# EAGLE design axiom_beta_plugin_module_3xmDP_v1.1 (EAGLE 7.0.0)
Assembly variants: Beta
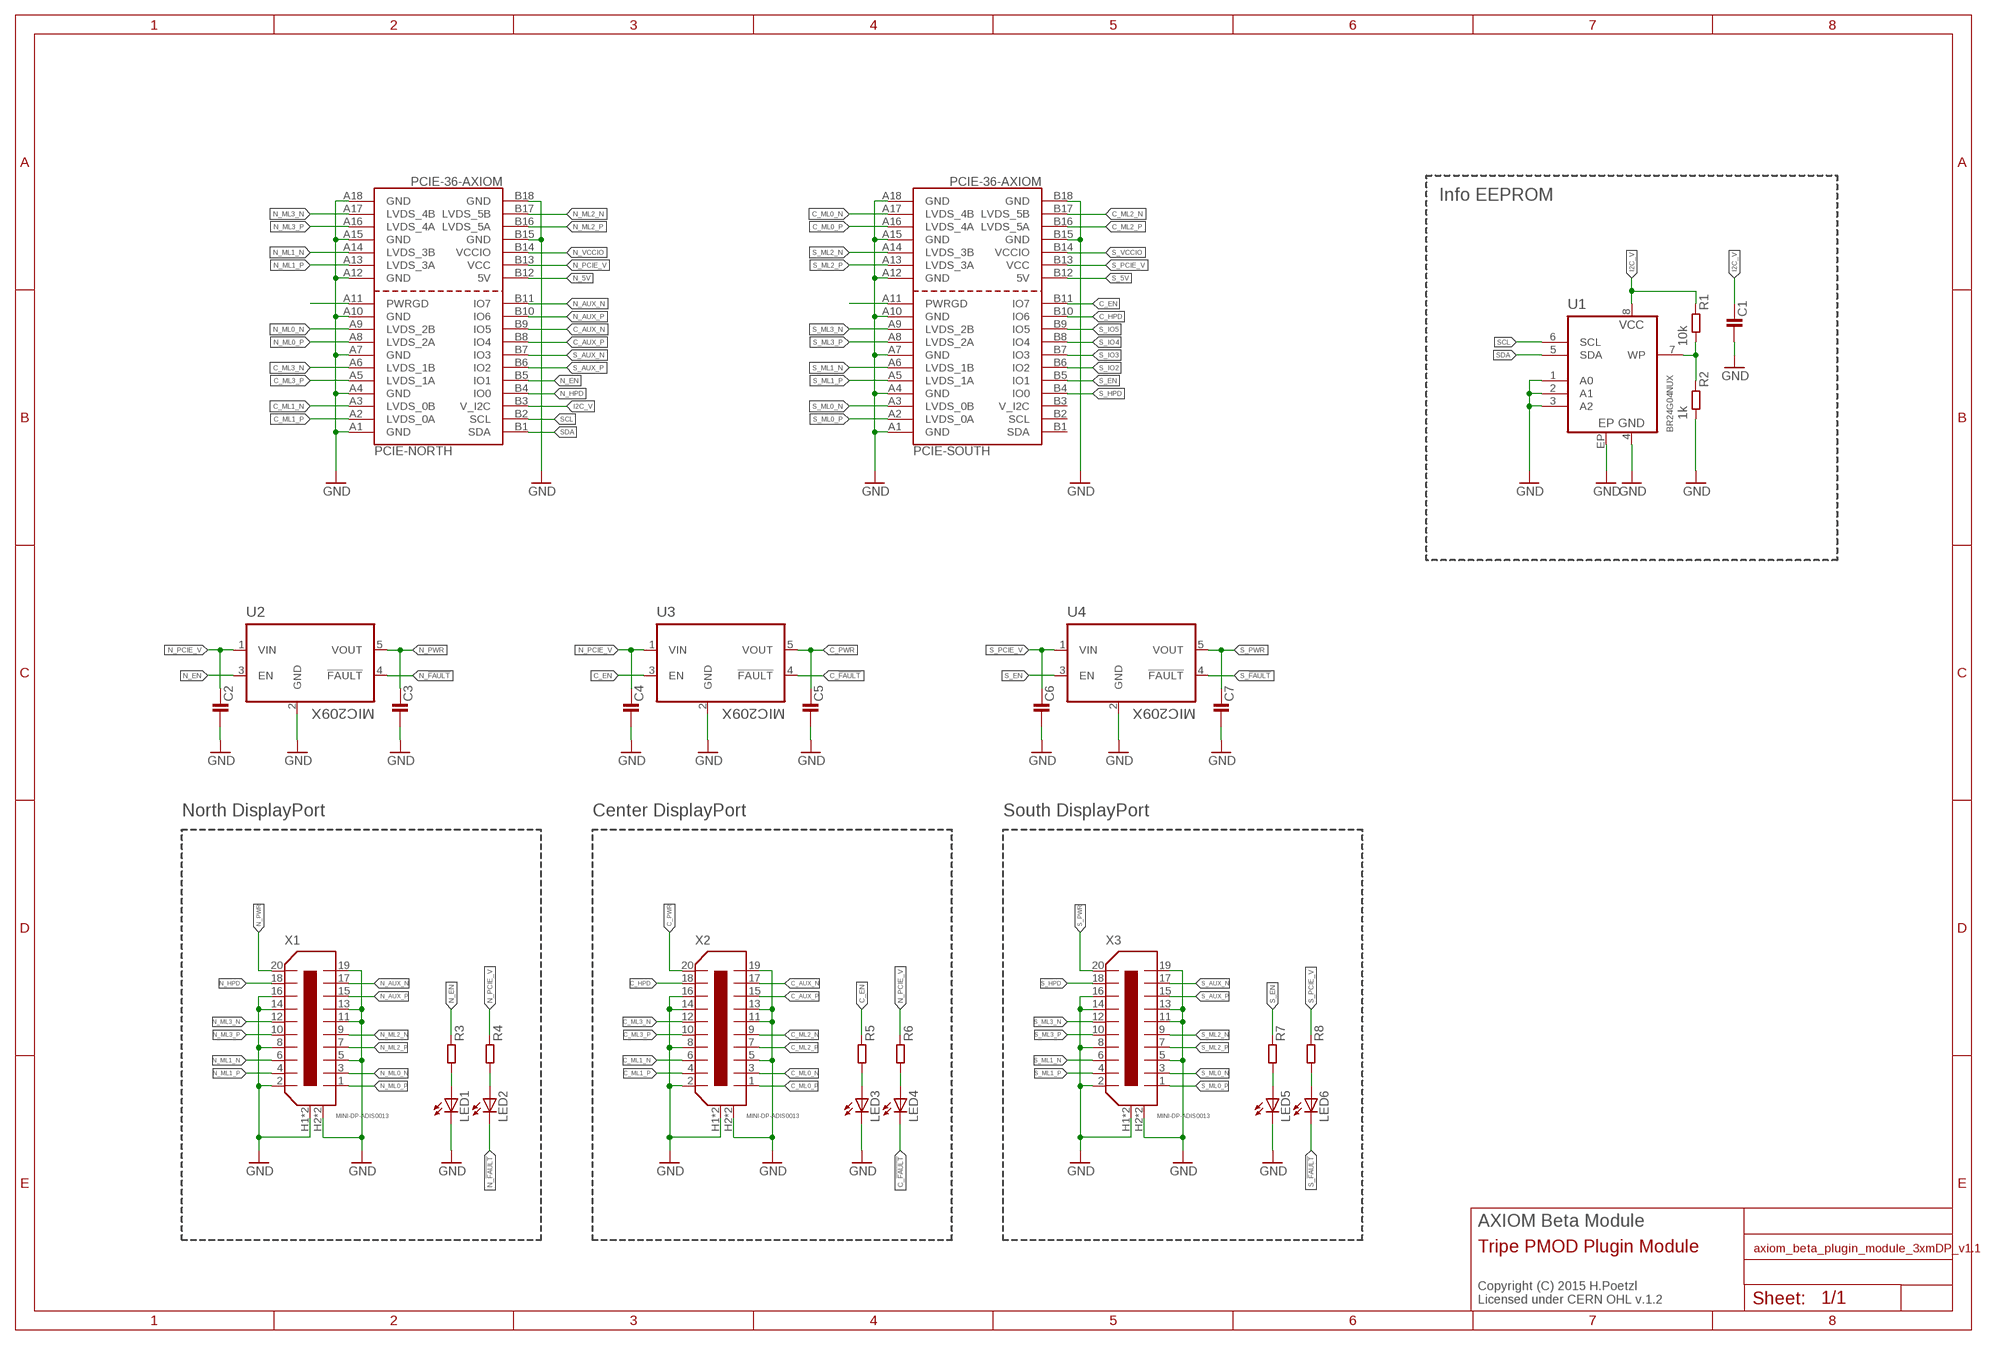
[diagram p0: schematic, sheet 1]

## Parts
C1  C0402-B  [0402-B]
C2  C0603-B  [0603-B]
C3  C0603-B  [0603-B]
C4  C0603-B  [0603-B]
C5  C0603-B  [0603-B]
C6  C0603-B  [0603-B]
C7  C0603-B  [0603-B]
LED1  LEDCHIPLED_0603  [CHIPLED_0603]
LED2  LEDCHIPLED_0603  [CHIPLED_0603]
LED3  LEDCHIPLED_0603  [CHIPLED_0603]
LED4  LEDCHIPLED_0603  [CHIPLED_0603]
LED5  LEDCHIPLED_0603  [CHIPLED_0603]
LED6  LEDCHIPLED_0603  [CHIPLED_0603]
PCIE-NORTH  PCIE-36-AXIOM  [PCIE-36-AXIOM]  (not fitted in variant Beta)
PCIE-SOUTH  PCIE-36-AXIOM  [PCIE-36-AXIOM]  (not fitted in variant Beta)
R1  10k  R0402-B  [0402-B]
R2  1k  R0402-B  [0402-B]
R3  R0402-B  [0402-B]
R4  R0402-B  [0402-B]
R5  R0402-B  [0402-B]
R6  R0402-B  [0402-B]
R7  R0402-B  [0402-B]
R8  R0402-B  [0402-B]
U1  BR24G04NUX  [DFN200X300X100-9N]
U2  MIC209X  [SOT95P280X145-5N]
U3  MIC209X  [SOT95P280X145-5N]
U4  MIC209X  [SOT95P280X145-5N]
X1  MINI-DP-ADIS0013  [ADIS0013]
X2  MINI-DP-ADIS0013  [ADIS0013]
X3  MINI-DP-ADIS0013  [ADIS0013]

## Nets
C_!FAULT: LED4.C U3.4(!FAULT)
C_AUX_N: PCIE-NORTH.B9(IO5) X2.17
C_AUX_P: PCIE-NORTH.B8(IO4) X2.15
C_EN: PCIE-SOUTH.B11(IO7) R5.1 U3.3(EN)
C_HPD: PCIE-SOUTH.B10(IO6) X2.18
C_ML0_N: PCIE-SOUTH.A17(LVDS_4B) X2.3
C_ML0_P: PCIE-SOUTH.A16(LVDS_4A) X2.1
C_ML1_N: PCIE-NORTH.A3(LVDS_0B) X2.6
C_ML1_P: PCIE-NORTH.A2(LVDS_0A) X2.4
C_ML2_N: PCIE-SOUTH.B17(LVDS_5B) X2.9
C_ML2_P: PCIE-SOUTH.B16(LVDS_5A) X2.7
C_ML3_N: PCIE-NORTH.A6(LVDS_1B) X2.12
C_ML3_P: PCIE-NORTH.A5(LVDS_1A) X2.10
C_PWR: C5.1 U3.5(VOUT) X2.20
GND: C1.2 C2.2 C3.2 C4.2 C5.2 C6.2 C7.2 LED1.C LED3.C LED5.C PCIE-NORTH.A1(GND) PCIE-NORTH.A4(GND) PCIE-NORTH.A7(GND) PCIE-NORTH.A10(GND) PCIE-NORTH.A12(GND) PCIE-NORTH.A15(GND) PCIE-NORTH.A18(GND) PCIE-NORTH.B15(GND) PCIE-NORTH.B18(GND) PCIE-SOUTH.A1(GND) PCIE-SOUTH.A4(GND) PCIE-SOUTH.A7(GND) PCIE-SOUTH.A10(GND) PCIE-SOUTH.A12(GND) PCIE-SOUTH.A15(GND) PCIE-SOUTH.A18(GND) PCIE-SOUTH.B15(GND) PCIE-SOUTH.B18(GND) R2.2 U1.1(A0) U1.2(A1) U1.3(A2) U1.4(GND) U1.EP U2.2(GND) U3.2(GND) U4.2(GND) X1.2 X1.5 X1.8 X1.11 X1.13 X1.14 X1.16 X1.19 X1.H1(M) X1.H2(M) X1.H3(M) X1.H4(M) X2.2 X2.5 X2.8 X2.11 X2.13 X2.14 X2.16 X2.19 X2.H1(M) X2.H2(M) X2.H3(M) X2.H4(M) X3.2 X3.5 X3.8 X3.11 X3.13 X3.14 X3.16 X3.19 X3.H1(M) X3.H2(M) X3.H3(M) X3.H4(M)
I2C_V: C1.1 PCIE-NORTH.B3(V_I2C) R1.1 U1.8(VCC)
N$196: LED3.A R5.2
N$197: LED4.A R6.2
N$198: LED1.A R3.2
N$202: LED2.A R4.2
N$209: PCIE-NORTH.A11(PWRGD)
N$216: R1.2 R2.1 U1.7(WP)
N$256: PCIE-SOUTH.A11(PWRGD)
N$324: LED5.A R7.2
N$325: LED6.A R8.2
N_5V: PCIE-NORTH.B12(5V)
N_!FAULT: LED2.C U2.4(!FAULT)
N_AUX_N: PCIE-NORTH.B11(IO7) X1.17
N_AUX_P: PCIE-NORTH.B10(IO6) X1.15
N_EN: PCIE-NORTH.B5(IO1) R3.1 U2.3(EN)
N_HPD: PCIE-NORTH.B4(IO0) X1.18
N_ML0_N: PCIE-NORTH.A9(LVDS_2B) X1.3
N_ML0_P: PCIE-NORTH.A8(LVDS_2A) X1.1
N_ML1_N: PCIE-NORTH.A14(LVDS_3B) X1.6
N_ML1_P: PCIE-NORTH.A13(LVDS_3A) X1.4
N_ML2_N: PCIE-NORTH.B17(LVDS_5B) X1.9
N_ML2_P: PCIE-NORTH.B16(LVDS_5A) X1.7
N_ML3_N: PCIE-NORTH.A17(LVDS_4B) X1.12
N_ML3_P: PCIE-NORTH.A16(LVDS_4A) X1.10
N_PCIE_V: C2.1 C4.1 PCIE-NORTH.B13(VCC) R4.1 R6.1 U2.1(VIN) U3.1(VIN)
N_PWR: C3.1 U2.5(VOUT) X1.20
N_VCCIO: PCIE-NORTH.B14(VCCIO)
S_5V: PCIE-SOUTH.B12(5V)
S_!FAULT: LED6.C U4.4(!FAULT)
S_AUX_N: PCIE-NORTH.B7(IO3) X3.17
S_AUX_P: PCIE-NORTH.B6(IO2) X3.15
S_EN: PCIE-SOUTH.B5(IO1) R7.1 U4.3(EN)
S_HPD: PCIE-SOUTH.B4(IO0) X3.18
S_IO2: PCIE-SOUTH.B6(IO2)
S_IO3: PCIE-SOUTH.B7(IO3)
S_IO4: PCIE-SOUTH.B8(IO4)
S_IO5: PCIE-SOUTH.B9(IO5)
S_ML0_N: PCIE-SOUTH.A3(LVDS_0B) X3.3
S_ML0_P: PCIE-SOUTH.A2(LVDS_0A) X3.1
S_ML1_N: PCIE-SOUTH.A6(LVDS_1B) X3.6
S_ML1_P: PCIE-SOUTH.A5(LVDS_1A) X3.4
S_ML2_N: PCIE-SOUTH.A14(LVDS_3B) X3.9
S_ML2_P: PCIE-SOUTH.A13(LVDS_3A) X3.7
S_ML3_N: PCIE-SOUTH.A9(LVDS_2B) X3.12
S_ML3_P: PCIE-SOUTH.A8(LVDS_2A) X3.10
S_PCIE_V: C6.1 PCIE-SOUTH.B13(VCC) R8.1 U4.1(VIN)
S_PWR: C7.1 U4.5(VOUT) X3.20
S_VCCIO: PCIE-SOUTH.B14(VCCIO)
SCL: PCIE-NORTH.B2(SCL) U1.6(SCL)
SDA: PCIE-NORTH.B1(SDA) U1.5(SDA)
Unconnected: PCIE-SOUTH.B1(SDA) PCIE-SOUTH.B2(SCL) PCIE-SOUTH.B3(V_I2C)

## Notes on the sheet
- Info EEPROM
- North DisplayPort | Center DisplayPort | South DisplayPort
- AXIOM Beta Module
- Tripe PMOD Plugin Module
- Copyright (C) 2015 H.Poetzl
  Licensed under CERN OHL v.1.2

## Library data of the parts
C1-C7 = generic-rcl:C
LED1-LED6 = led:LED: LED OSRAM: - CHIPLED LG R971, LG N971, LY N971, LG Q971, LY Q971, LO R971, LY R971 LH N974, LH R974 LS Q976, LO Q976, LY Q976 LO Q996 - Hyper CHIPLED LW Q18S LB Q993, LB Q99A, LB R99A - SideLED LS A670, LO A670, LY A670, LG A670, LP A670 LB A673, LV A673, LT A673, LW A673 LH A674 LY A675 LS A676, LA A676, LO A676, LY A676, LW A676 LS A679, LY A679, LG A679 - Hyper Micro SIDELED® LS Y876, LA Y876, LO Y876, LY Y876 LT Y87S - SmartLED LW L88C, LW L88S LB L89C, LB L89S, LG L890 LS L89K, LO L89K, LY L89K LS L896, LA L896, LO L896, LY L896 - TOPLED LS T670, LO T670, LY T670, LG T670, LP T670 LSG T670, LSP T670, LSY T670, LOP T670, LYG T670 LG T671, LOG T671, LSG T671 LB T673, LV T673, LT T673, LW T673 LH T674 LS T676, LA T676, LO T676, LY T676, LB T676, LH T676, LSB T676, LW T676 LB T67C, LV T67C, LT T67C, LS T67K, LO T67K, LY T67K, LW E67C LS E67B, LA E67B, LO E67B, LY E67B, LB E67C, LV E67C, LT E67C LW T67C LS T679, LY T679, LG T679 LS T770, LO T770, LY T770, LG T770, LP T770 LB T773, LV T773, LT T773, LW T773 LH T774 LS E675, LA E675, LY E675, LS T675 LS T776, LA T776, LO T776, LY T776, LB T776 LHGB T686 LT T68C, LB T68C - Hyper Mini TOPLED® LB M676 - Mini TOPLED Santana® LG M470 LS M47K, LO M47K, LY M47K Source: http://www.osram.convergy.de LUXEON: - LUMILED® LXK2-PW12-R00, LXK2-PW12-S00, LXK2-PW14-U00, LXK2-PW14-V00 LXK2-PM12-R00, LXK2-PM12-S00, LXK2-PM14-U00 LXK2-PE12-Q00, LXK2-PE12-R00, LXK2-PE12-S00, LXK2-PE14-T00, LXK2-PE14-U00 LXK2-PB12-K00, LXK2-PB12-L00, LXK2-PB12-M00, LXK2-PB14-N00, LXK2-PB14-P00, LXK2-PB14-Q00 LXK2-PR12-L00, LXK2-PR12-M00, LXK2-PR14-Q00, LXK2-PR14-R00 LXK2-PD12-Q00, LXK2-PD12-R00, LXK2-PD12-S00 LXK2-PH12-R00, LXK2-PH12-S00 LXK2-PL12-P00, LXK2-PL12-Q00, LXK2-PL12-R00 Source: www.luxeon.com KINGBRIGHT: KA-3528ASYC Source: www.kingbright.com
PCIE-NORTH PCIE-SOUTH = PCIe:PCIE-36-AXIOM
R1-R8 = generic-rcl:R
U1 = eeprom:BR24G04
U2-U4 = mic209x:MIC209X: Current Limiting Power Distribution Switches; MPN: MIC2090-1YM5TR; OC_FARNELL: 1924707; OC_NEWARK: 58T4896; PACKAGE: SOT-23-5; SUPPLIER: MICREL SEMICONDUCTOR
X1-X3 = displayport:MINI-DP: RIGHT ANGLE MINI-DISPLAYPORT RECEPTACLE Source: http://www.molex.com/pdm_docs/sd/1050810001_sd.pdf

## Net classes
0 default: width 0.152 mm, drill 0.254 mm, clearance 0.152 mm
1 LVDS: width 0.152 mm, drill 0.254 mm, clearance 0.152 mm

## Board
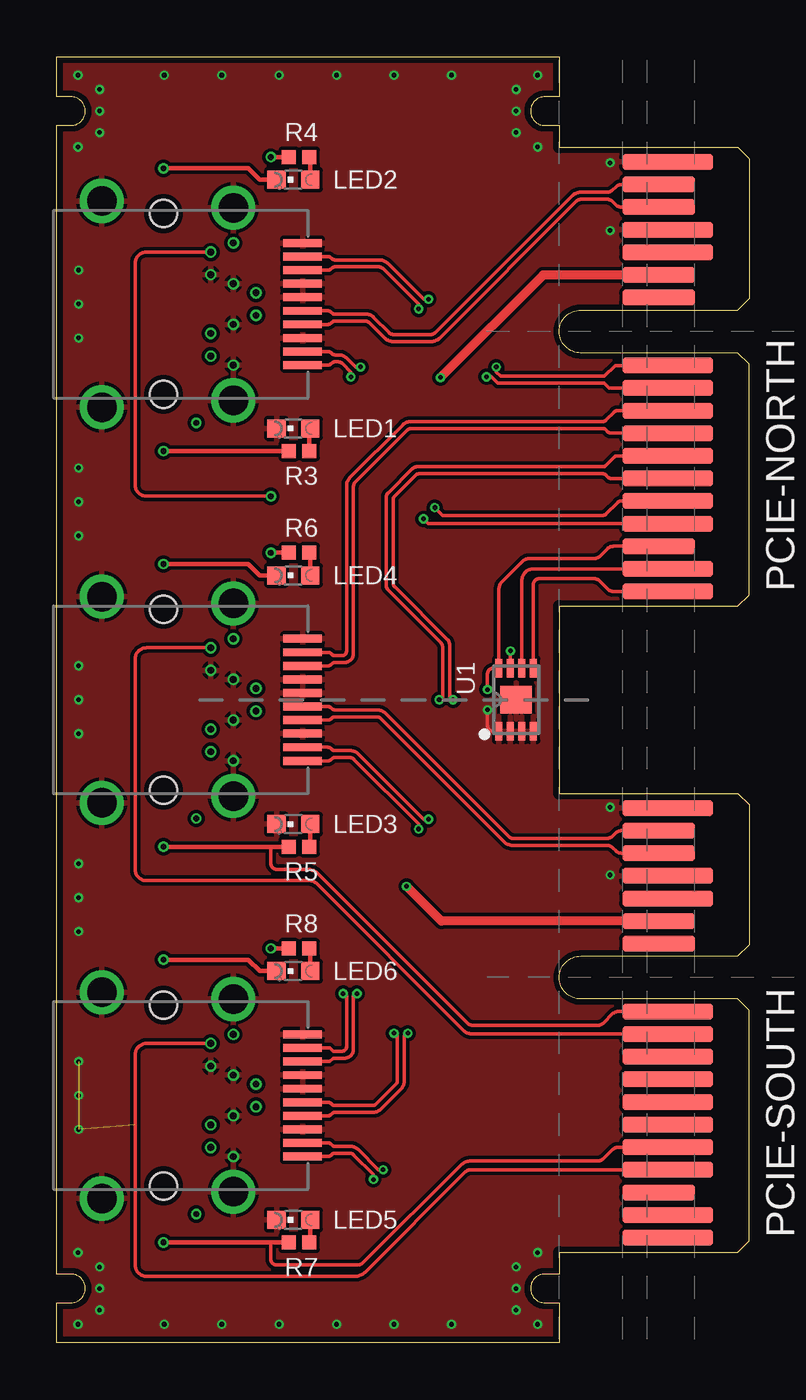
[diagram p1: board, top side]
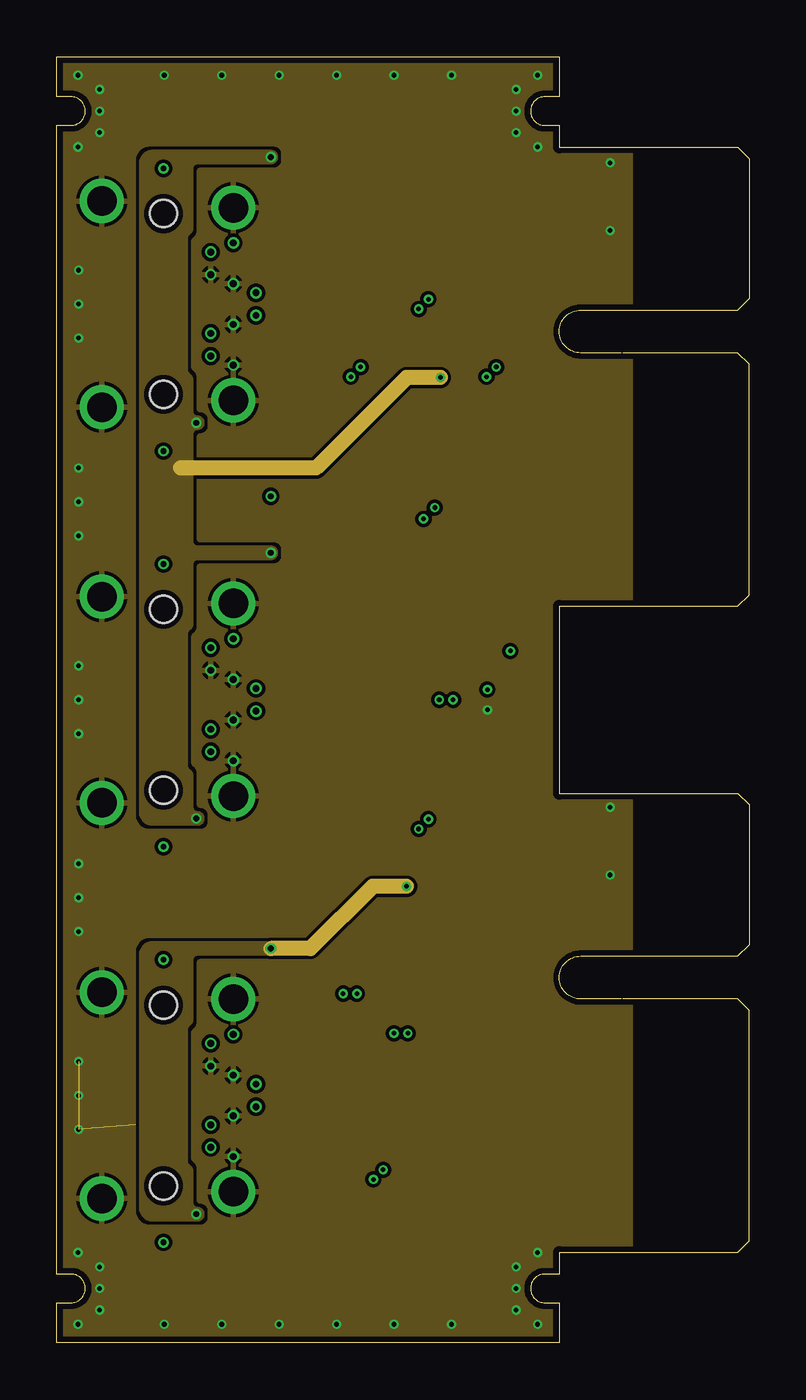
[diagram p2: board, inner layer Route2]
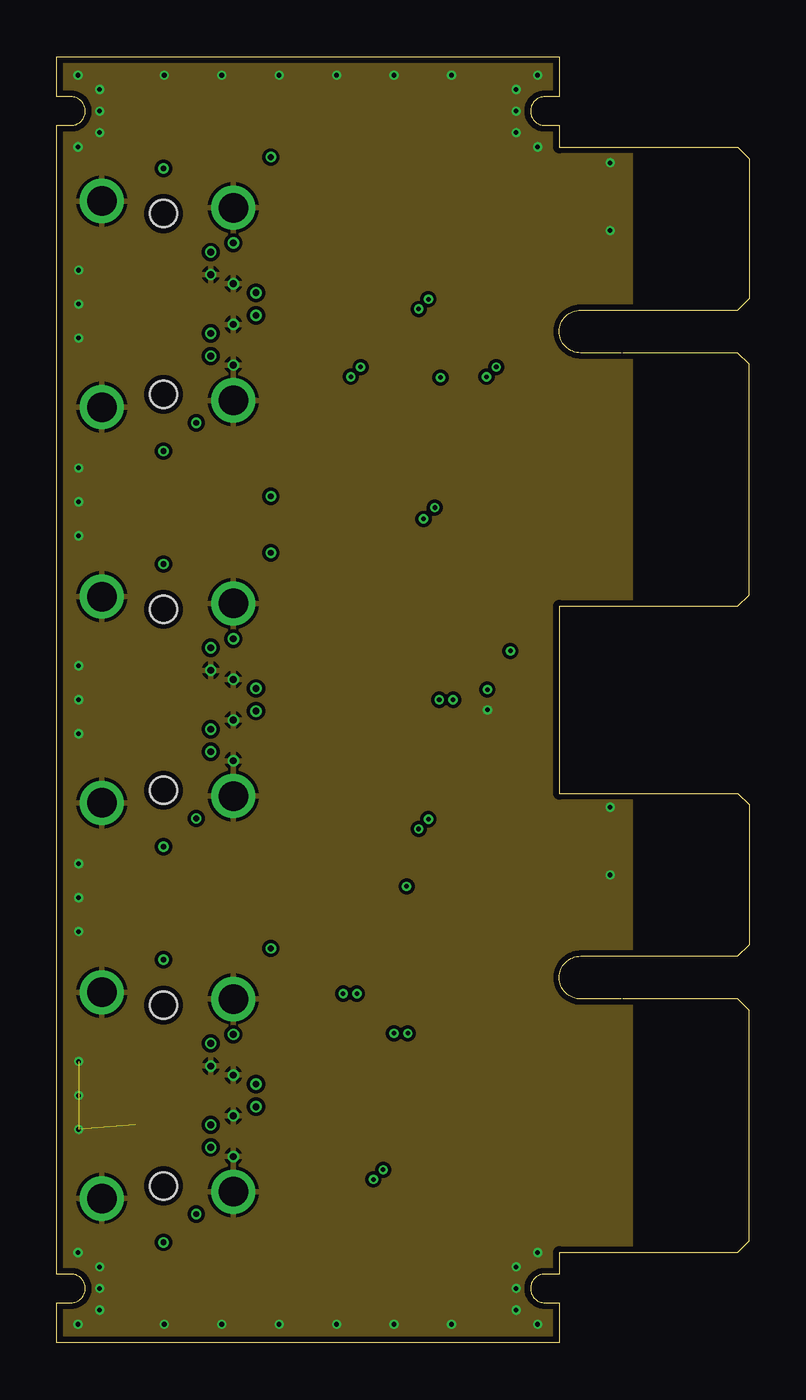
[diagram p3: board, inner layer Route15]
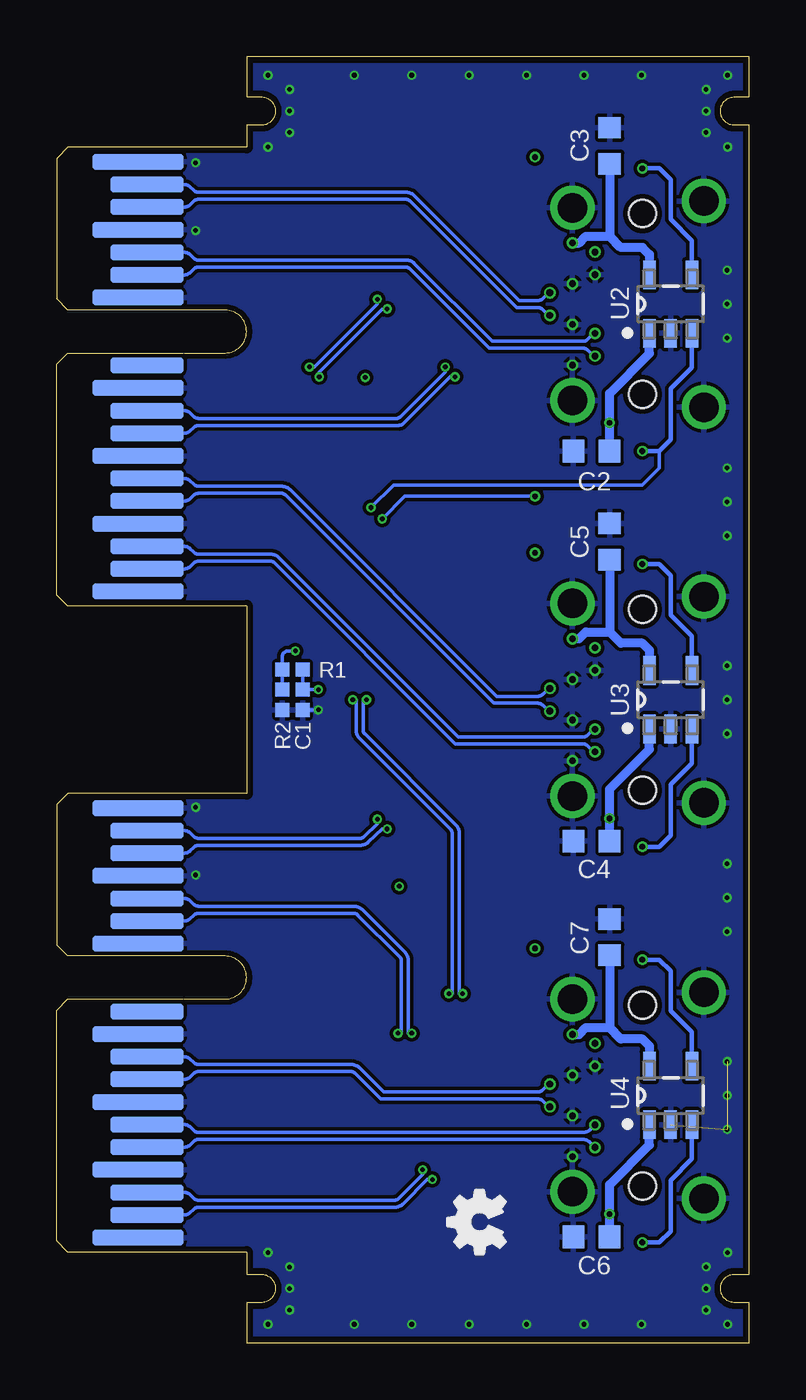
[diagram p4: board, bottom side, seen from below]

Size 30.62 x 56.9 mm. Coordinates in mm from the lower left corner, seen from the top.
Outline: 22.23,32.59 22.23,24.31
Outline: 22.23,52.89 22.23,53.85 21.59,53.85 arc-90 20.96,54.48 arc-90 21.59,55.12 22.23,55.12 22.23,56.9 0,56.9 0,55.12 0.64,55.12 arc-90 1.27,54.48 arc-90 0.64,53.85 0,53.85 0,3.05 0.64,3.05 arc-90 1.27,2.41 arc-90 0.64,1.78 0,1.78 0,0 22.23,0 22.23,1.78 21.59,1.78 arc-90 20.96,2.41 arc-90 21.59,3.05 22.23,3.05 22.23,4.01
Copper layers (1*2*15*16): Top 0.035559375mm / dielectric 0.17018125mm / Route2 0.01778125mm / dielectric 47mil / Route15 0.01778125mm / dielectric 0.17018125mm / Bottom 0.035559375mm
Design rules "OSHPark-4layer-tuned *": minimum track width 5mil, minimum drill 10mil, track to track 6mil, track to pad 5mil, pad to pad 5mil, via to via 5mil, smd to smd 5mil, copper to edge 10mil, drill to drill 6mil, minimum pad ring 4mil, minimum via ring 4mil, stop-mask expansion 2mil, vias tented up to drill 16mil, thermal gap 6mil
tKeepout: area 20,52.9 to 23.2,56.1; area 20,0.8 to 23.2,4; area -1,52.9 to 2.2,56.1; area -1,0.8 to 2.2,4
bKeepout: area 20,52.9 to 23.2,56.1; area 20,0.8 to 23.2,4; area -1,52.9 to 2.2,56.1; area -1,0.8 to 2.2,4

### Footprints (pad centres in the part's own frame; a part is rotated, then mirrored left to right if it is on the bottom)
0402-B = smd 0.62 x 0.62: 1 -0.45,0; 2 0.45,0
0603-B = smd 0.95 x 1: 1 -0.8,0; 2 0.8,0
CHIPLED_0603 = smd 0.8 x 0.8: A 0,-0.75; C 0,0.75
PCIE-36-AXIOM = smd 0.7 x 4 bottom: A1 -11.5,3.6; A4 -8.5,3.6; A7 -5.5,3.6; A10 -2.5,3.6; A12 1.5,3.6; A15 4.5,3.6; A18 7.5,3.6 | smd 0.7 x 3.2 bottom: A2 -10.5,4; A3 -9.5,4; A5 -7.5,4; A6 -6.5,4; A8 -4.5,4; A9 -3.5,4; A11 -1.5,4; A13 2.5,4; A14 3.5,4; A16 5.5,4; A17 6.5,4 | smd 0.7 x 4: B1 -11.5,3.6; B2 -10.5,3.6; B4 -8.5,3.6; B5 -7.5,3.6; B6 -6.5,3.6; B7 -5.5,3.6; B8 -4.5,3.6; B9 -3.5,3.6; B10 -2.5,3.6; B11 -1.5,3.6; B14 3.5,3.6; B15 4.5,3.6; B18 7.5,3.6 | smd 0.7 x 3.2: B3 -9.5,4; B12 1.5,4; B13 2.5,4; B16 5.5,4; B17 6.5,4
DFN200X300X100-9N = smd 0.813 x 0.305: 1 -1.397,0.762; 2 -1.397,0.254; 3 -1.397,-0.254; 4 -1.397,-0.762; 5 1.397,-0.762; 6 1.397,-0.254; 7 1.397,0.254; 8 1.397,0.762 | smd 1.194 x 1.397: EP 0,0
SOT95P280X145-5N = smd 1.27 x 0.559: 1 -1.295,0.94; 2 -1.295,0; 3 -1.295,-0.94; 4 1.295,-0.94; 5 1.295,0.94
ADIS0013 = smd 0.35 x 1.7: 1 -2.7,-6.15; 3 -2.1,-6.15; 5 -1.5,-6.15; 7 -0.9,-6.15; 9 -0.3,-6.15; 11 0.3,-6.15; 13 0.9,-6.15; 15 1.5,-6.15; 17 2.1,-6.15; 19 2.7,-6.15 | drill 0.3: 2 -2.7,-3.09; 4 -2.3,-2.09; 6 -1.3,-2.09; 8 -0.9,-3.09; 10 -0.5,-4.09; 12 0.5,-4.09; 14 0.9,-3.09; 16 1.3,-2.09; 18 2.3,-2.09; 20 2.7,-3.09 | drill 1.3: H1 -4.26,-3.09; H2 -4.56,2.72; H3 4.56,2.72; H4 4.26,-3.09 | hole 1.2: -4,0; 4,0

### Placement (x,y rotation side)
C1  19.75,28.45 270 bottom
C2  6.98,39.45 180 bottom
C3  6.18,52.95 90 bottom
C4  6.98,22.2 180 bottom
C5  6.18,35.45 90 bottom
C6  6.98,4.7 180 bottom
C7  6.18,17.95 90 bottom
LED1  10.48,40.45 90 top
LED2  10.48,51.45 90 top
LED3  10.48,22.95 90 top
LED4  10.48,33.95 90 top
LED5  10.48,5.45 90 top
LED6  10.48,16.45 90 top
LOGO1  OSHW_LOGO_FILLX0100-NT  [OSHW_FILLX100_NOTEXT]  10.8,3.94 90 bottom
PCIE-NORTH  30.62,44.74 90 top  (not fitted)
PCIE-SOUTH  30.62,16.16 90 top  (not fitted)
R1  20.19,29.78 180 bottom
R2  20.64,28.45 270 bottom
R3  10.73,39.45 0 top
R4  10.73,52.45 0 top
R5  10.73,21.95 0 top
R6  10.73,34.95 0 top
R7  10.73,4.45 0 top
R8  10.73,17.45 0 top
U1  20.32,28.45 90 top
U2  3.48,45.95 90 bottom
U3  3.48,28.45 90 bottom
U4  3.48,10.95 90 bottom
X1  4.73,45.95 90 top
X2  4.73,28.45 90 top
X3  4.73,10.95 90 top

### Tracks (layer width: path | path; a pad name or v marks a point on that pad's centre or on a via)
C_!FAULT  (via drill 0.25)
  Top 0.203: LED4.C 8.98,33.95 8.48,34.45 v4.73,34.45
  Bottom 0.203: v4.73,34.45 3.98,34.45 3.48,33.95 3.48,32.2 2.54,31.26 U3.4
C_AUX_N
  Top 0.152: PCIE-NORTH.B9 24.79,41.23 arc45 24.65,41.18 24.28,40.81 arc-45 24.14,40.75 15.66,40.75 arc45 15.3,40.6 12.97,38.27 arc45 12.82,37.92 12.82,30.6 arc-90 12.62,30.4 12.31,30.4 arc-45 12.17,30.46 12.14,30.49 arc45 12,30.55 X2.17
C_AUX_P
  Top 0.152: PCIE-NORTH.B8 24.52,40.23 arc-45 24.38,40.29 24.28,40.39 arc45 24.14,40.45 15.7,40.45 arc45 15.49,40.36 13.22,38.09 arc45 13.13,37.87 13.13,30.5 arc-90 12.73,30.1 12.31,30.1 arc45 12.17,30.04 12.14,30.01 arc-45 12,29.95 X2.15
C_EN  (via drill 0.25)
  Top 0.152: PCIE-SOUTH.B11 24.85,14.66 arc45 24.58,14.55 24.19,14.16 arc-45 23.92,14.05 18.42,14.05 arc-45 18.15,14.16 11.55,20.76 arc45 11.1,20.95 9.73,20.95 arc-90 9.48,21.2 9.48,21.95
  Top 0.203: R5.1 9.48,21.95 v4.73,21.95
  Bottom 0.203: v4.73,21.95 3.98,21.95 3.48,22.45 3.48,24.7 2.54,25.64 U3.3
C_HPD
  Top 0.152: PCIE-SOUTH.B10 18.41,13.66 arc-45 17.96,13.85 11.47,20.34 arc45 11.2,20.45 3.98,20.45 arc-90 3.48,20.96 3.48,30.24 arc-90 3.98,30.75 X2.18
C_ML0_N  (via drill 0.2)
  Top 0.152: X2.3 12,26.35 arc-45 12.14,26.29 12.17,26.26 arc45 12.31,26.2 12.98,26.2 arc-45 13.34,26.05 16.23,23.16 v16.44,23.16
  Bottom 0.152: PCIE-SOUTH.A17 24.98,22.66 arc45 24.72,22.55 24.59,22.42 arc-45 24.32,22.31 17.24,22.31 arc-45 17.03,22.4 16.44,22.95 v16.44,23.16
C_ML0_P  (via drill 0.2)
  Top 0.152: X2.1 12,25.75 arc45 12.14,25.81 12.17,25.84 arc-45 12.31,25.9 12.94,25.9 arc-45 13.15,25.81 16.01,22.95 v16.01,22.73
  Bottom 0.152: PCIE-SOUTH.A16 24.98,21.66 arc-45 24.72,21.77 24.59,21.9 arc45 24.32,22.01 17.19,22.01 arc-45 16.84,22.16 16.23,22.73 v16.01,22.73
C_ML1_N
  Bottom 0.152: PCIE-NORTH.A3 24.98,35.23 arc45 24.72,35.12 24.59,35 arc-45 24.32,34.89 21.16,34.89 arc45 20.8,34.74 12.86,26.8 7.35,26.8 arc-45 7.14,26.89 6.88,27.15 X2.6
C_ML1_P
  Bottom 0.152: PCIE-NORTH.A2 24.98,34.23 arc-45 24.72,34.35 24.59,34.47 arc45 24.32,34.58 21.2,34.58 arc45 20.99,34.49 12.99,26.5 7.35,26.5 arc45 7.14,26.41 6.88,26.15 X2.4
C_ML2_N
  Top 0.152: PCIE-SOUTH.B17 24.98,22.66 arc45 24.72,22.55 24.59,22.42 arc-45 24.32,22.31 20.2,22.31 arc-45 19.99,22.4 14.54,27.85 arc45 14.18,28 12.31,28 arc-45 12.17,28.06 12.14,28.09 arc45 12,28.15 X2.9
C_ML2_P
  Top 0.152: PCIE-SOUTH.B16 24.98,21.66 arc-45 24.72,21.77 24.59,21.9 arc45 24.32,22.01 20.16,22.01 arc-45 19.8,22.16 14.35,27.61 arc45 14.14,27.7 12.31,27.7 arc45 12.17,27.64 12.14,27.61 arc-45 12,27.55 X2.7
C_ML3_N
  Bottom 0.152: PCIE-NORTH.A6 24.98,38.23 arc45 24.72,38.12 24.59,38 arc-45 24.32,37.89 20.66,37.89 arc45 20.3,37.74 11.16,28.6 9.35,28.6 arc-45 9.14,28.69 8.88,28.95 X2.12
C_ML3_P
  Bottom 0.152: PCIE-NORTH.A5 24.98,37.23 arc-45 24.72,37.35 24.59,37.47 arc45 24.32,37.58 20.7,37.58 arc45 20.49,37.5 11.29,28.3 9.35,28.3 arc45 9.14,28.21 8.88,27.95 X2.10
C_PWR
  Bottom 0.406: X2.20 7.53,31.15 7.23,31.45 6.18,31.45 | U3.5 4.42,30.64 4.73,30.95 5.68,30.95 6.18,31.45 | C5.1 6.18,31.45
GND  (via drill 0.2)  (3 unrouted)
  Top 0.152: U1.1 19.3,27.05 arc-90 19.05,27.3 v19.05,28
  Bottom 0.152: v19.05,28 C1.2
  other vias: 21.27,0.83 20.32,1.46 20.32,2.41 20.32,3.37 21.27,4 21.27,56.07 21.27,52.9 20.32,53.53 20.32,55.44 20.32,54.48 0.95,56.07 0.95,0.83 4.76,56.07 17.46,56.07 4.76,0.83 0.95,4 0.95,52.9 1.91,53.53 17.46,0.83 7.3,56.07 9.84,56.07 12.38,56.07 1.91,55.44 1.91,1.46 1.91,3.37 9.84,0.83 12.38,0.83 7.3,0.83 14.92,0.83 1.91,54.48 1.91,2.41 14.92,56.07 0.98,38.7 0.98,35.7 0.98,37.2 24.48,49.2 24.48,52.2 24.48,23.7 24.48,20.7 0.98,47.45 0.98,44.45 0.98,45.95 0.98,29.95 0.98,26.95 0.98,28.45 0.98,21.2 0.98,18.2 0.98,19.7 0.98,12.45 0.98,9.45 0.98,10.95
  pour Top (isolate 0.152): 0.03,56.9 22.23,56.9 22.23,53.21 25.4,53.21 25.4,3.68 22.23,3.68 22.23,0 0.03,0
  pour Bottom (isolate 0.152): 0.03,56.9 22.23,56.9 22.23,53.21 25.4,53.21 25.4,3.68 22.23,3.68 22.23,0 0.03,0
  pour Route2 (isolate 0.152, rank 3): 0.03,56.9 22.23,56.9 22.23,53.21 25.4,53.21 25.4,3.68 22.23,3.68 22.23,0 0.03,0
  pour Route15 (isolate 0.152): 0.03,56.9 22.23,56.9 22.23,53.21 25.4,53.21 25.4,3.68 22.23,3.68 22.23,0 0.03,0
I2C_V  (via drill 0.2)
  Top 0.152: v19.05,28.9 19.05,29.59 arc-90 19.3,29.84 U1.8 19.56,33.33 arc-45 19.7,33.68 20.57,34.55 arc-45 20.93,34.7 23.76,34.7 arc45 24.03,34.81 24.35,35.12 arc-45 24.62,35.23 PCIE-NORTH.B3
  Bottom 0.152: v19.05,28.9 C1.1 R1.1
N$196
  Top 0.203: LED3.A 11.23,21.95 R5.2
N$197
  Top 0.203: LED4.A 11.23,34.95 R6.2
N$198
  Top 0.203: R3.2 11.18,40.45 LED1.A
N$202
  Top 0.203: LED2.A 11.23,52.45 R4.2
N$216  (via drill 0.2)
  Top 0.152: U1.7 v20.07,30.61
  Bottom 0.152: R2.1 R1.2 20.64,30.35 arc90 20.39,30.61 v20.07,30.61
N$324
  Top 0.203: LED5.A 11.23,4.45 R7.2
N$325
  Top 0.203: LED6.A 11.23,17.45 R8.2
N_!FAULT  (via drill 0.25)
  Top 0.203: LED2.C 8.98,51.45 8.48,51.95 v4.73,51.95
  Bottom 0.203: v4.73,51.95 3.98,51.95 3.48,51.45 3.48,49.7 2.54,48.76 U2.4
N_AUX_N  (via drill 0.2)
  Top 0.152: v19.44,43.16 19.44,42.95 19.64,42.75 24.23,42.75 24.71,43.23 PCIE-NORTH.B11 | v16.44,46.16 16.23,46.16 14.64,47.75 arc45 14.28,47.9 12.31,47.9 arc-45 12.17,47.96 12.14,47.99 arc45 12,48.05 X1.17
  Bottom 0.152: v19.44,43.16 19.23,43.16 16.44,45.95 v16.44,46.16
N_AUX_P  (via drill 0.2)
  Top 0.152: v19.01,42.73 19.23,42.73 19.51,42.45 24.23,42.45 24.44,42.23 PCIE-NORTH.B10 | v16.01,45.73 16.01,45.95 14.45,47.51 arc45 14.24,47.6 12.31,47.6 arc45 12.17,47.54 12.14,47.51 arc-45 12,47.45 X1.15
  Bottom 0.152: v19.01,42.73 19.01,42.95 16.23,45.73 v16.01,45.73
N_EN  (via drill 0.2, 0.25)
  Top 0.152: v16.73,36.95 17.07,36.6 24.14,36.6 arc45 24.28,36.66 24.8,37.18 arc-45 24.95,37.23 PCIE-NORTH.B5
  Top 0.203: R3.1 v4.73,39.45
  Bottom 0.152: v16.73,36.95 15.73,37.95 4.73,37.95 3.98,38.7 3.98,39.45
  Bottom 0.203: v4.73,39.45 3.98,39.45 3.48,39.95 3.48,42.2 2.54,43.14 U2.3
N_HPD  (via drill 0.2, 0.25)
  Top 0.152: PCIE-NORTH.B4 16.44,36.23 v16.23,36.45 | v9.48,37.45 3.98,37.45 arc-90 3.48,37.96 3.48,47.74 arc-90 3.98,48.25 X1.18
  Bottom 0.152: v16.23,36.45 15.23,37.45 v9.48,37.45
N_ML0_N  (via drill 0.2)
  Top 0.152: X1.3 12,43.85 arc-45 12.14,43.79 12.17,43.76 arc45 12.31,43.7 12.48,43.7 arc-45 12.84,43.55 13.23,43.16 v13.44,43.16
  Bottom 0.152: PCIE-NORTH.A9 24.98,41.23 arc45 24.72,41.12 24.59,41 arc-45 24.32,40.89 15.63,40.89 arc-45 15.41,40.98 13.44,42.95 v13.44,43.16
N_ML0_P  (via drill 0.2)
  Top 0.152: X1.1 12,43.25 arc45 12.14,43.31 12.17,43.34 arc-45 12.31,43.4 12.44,43.4 arc-45 12.65,43.31 13.01,42.95 v13.01,42.73
  Bottom 0.152: PCIE-NORTH.A8 24.98,40.23 arc-45 24.72,40.35 24.59,40.47 arc45 24.32,40.58 15.5,40.58 arc-45 15.29,40.67 13.23,42.73 v13.01,42.73
N_ML1_N
  Bottom 0.152: PCIE-NORTH.A14 24.98,48.24 arc45 24.72,48.12 24.59,48 arc-45 24.32,47.89 15.16,47.89 arc45 14.8,47.74 11.36,44.3 7.35,44.3 arc-45 7.14,44.39 6.88,44.65 X1.6
N_ML1_P
  Bottom 0.152: PCIE-NORTH.A13 24.98,47.24 arc-45 24.72,47.35 24.59,47.47 arc45 24.32,47.58 15.2,47.58 arc45 14.99,47.5 11.49,44 7.35,44 arc45 7.14,43.91 6.88,43.65 X1.4
N_ML2_N
  Top 0.152: PCIE-NORTH.B17 24.98,51.24 arc45 24.72,51.12 24.59,51 arc-45 24.32,50.89 23.16,50.89 arc45 22.8,50.74 16.75,44.69 arc-45 16.54,44.6 14.91,44.6 arc-45 14.7,44.69 14.04,45.35 arc45 13.68,45.5 12.31,45.5 arc-45 12.17,45.56 12.14,45.59 arc45 12,45.65 X1.9
N_ML2_P
  Top 0.152: PCIE-NORTH.B16 24.98,50.24 arc-45 24.72,50.35 24.59,50.47 arc45 24.32,50.58 23.2,50.58 arc45 22.99,50.5 16.94,44.44 arc-45 16.58,44.3 14.87,44.3 arc-45 14.52,44.44 13.85,45.11 arc45 13.64,45.2 12.31,45.2 arc45 12.17,45.14 12.14,45.11 arc-45 12,45.05 X1.7
N_ML3_N
  Bottom 0.152: PCIE-NORTH.A17 24.98,51.24 arc45 24.72,51.12 24.59,51 arc-45 24.32,50.89 15.16,50.89 arc45 14.8,50.74 10.16,46.1 9.35,46.1 arc-45 9.14,46.19 8.88,46.45 X1.12
N_ML3_P
  Bottom 0.152: PCIE-NORTH.A16 24.98,50.24 arc-45 24.72,50.35 24.59,50.47 arc45 24.32,50.58 15.2,50.58 arc45 14.99,50.5 10.29,45.8 9.35,45.8 arc45 9.14,45.71 8.88,45.45 X1.10
N_PCIE_V  (via drill 0.2, 0.25)
  Top 0.203: R6.1 v9.48,34.95 | R4.1 v9.48,52.45
  Top 0.406: PCIE-NORTH.B13 21.51,47.24 v16.98,42.7
  Route2 0.652: v16.98,42.7 15.48,42.7 11.48,38.7 5.48,38.7
  Bottom 0.406: C4.1 v6.18,23.2 6.18,24.5 4.42,26.26 U3.1 | C2.1 v6.18,40.7 6.18,42 4.42,43.76 U2.1
  pour Route2: 3.73,23.46 3.73,52.19 arc-90 4.23,52.7 9.47,52.7 arc-90 9.73,52.44 arc-90 9.48,52.2 6.23,52.2 arc90 5.98,51.94 5.98,49.3 arc-45 5.9,49.12 5.8,49.02 arc45 5.73,48.84 5.73,43.05 arc45 5.8,42.87 5.9,42.77 arc-45 5.98,42.59 5.98,41.2 arc90 6.23,40.95 arc-90 6.48,40.7 6.48,40.69 arc-90 6.23,40.45 arc90 5.98,40.19 5.98,35.45 arc90 6.23,35.2 9.47,35.2 arc-90 9.73,34.94 arc-90 9.48,34.7 6.23,34.7 arc90 5.98,34.44 5.98,31.8 arc-45 5.9,31.62 5.8,31.52 arc45 5.73,31.34 5.73,25.55 arc45 5.8,25.37 5.9,25.27 arc-45 5.98,25.09 5.98,23.7 arc90 6.23,23.45 arc-90 6.48,23.2 arc-90 6.22,22.95 4.23,22.95 arc-90
N_PWR
  Bottom 0.406: X1.20 7.53,48.65 7.23,48.95 6.18,48.95 | U2.5 4.42,48.14 4.73,48.45 5.68,48.45 6.18,48.95 | C3.1 6.18,48.95
S_!FAULT  (via drill 0.25)
  Top 0.203: LED6.C 8.98,16.45 8.48,16.95 v4.73,16.95
  Bottom 0.203: v4.73,16.95 3.98,16.95 3.48,16.45 3.48,14.7 2.54,13.76 U4.4
S_AUX_N  (via drill 0.2)
  Top 0.152: PCIE-NORTH.B7 24.79,39.23 arc45 24.65,39.18 24.28,38.81 arc-45 24.14,38.75 15.94,38.75 arc45 15.73,38.66 14.66,37.6 arc45 14.57,37.39 14.57,33.51 arc45 14.66,33.3 16.98,30.97 arc-45 17.07,30.76 17.07,28.57 v16.92,28.45 | X3.17 12.08,13.05 12.23,12.9 12.62,12.9 arc90 12.82,13.1 12.82,15.32 v12.67,15.45
  Bottom 0.152: v16.92,28.45 17.07,28.45 17.07,27.14 arc-45 16.98,26.92 12.97,22.91 arc45 12.82,22.55 12.82,15.45 v12.67,15.45
S_AUX_P  (via drill 0.2)
  Top 0.152: PCIE-NORTH.B6 24.52,38.23 arc-45 24.38,38.29 24.28,38.39 arc45 24.14,38.45 16.06,38.45 arc45 15.85,38.36 14.97,37.47 arc45 14.88,37.26 14.88,33.63 arc45 14.97,33.42 17.29,31.1 arc-45 17.38,30.89 17.38,28.57 v17.53,28.45 | X3.15 12.08,12.45 12.23,12.6 12.73,12.6 arc90 13.13,13 13.13,15.32 v13.28,15.45
  Bottom 0.152: v17.53,28.45 17.38,28.45 17.38,27.09 arc-45 17.23,26.74 13.22,22.72 arc45 13.13,22.51 13.13,15.45 v13.28,15.45
S_EN  (via drill 0.25)
  Top 0.152: PCIE-SOUTH.B5 24.85,8.66 arc45 24.58,8.55 24.19,8.16 arc-45 23.92,8.05 18.32,8.05 arc45 17.87,7.86 13.57,3.56 arc-45 13.3,3.45 9.73,3.45 arc-90 9.48,3.7 9.48,4.45
  Top 0.203: R7.1 9.48,4.45 v4.73,4.45
  Bottom 0.203: v4.73,4.45 3.98,4.45 3.48,4.95 3.48,7.2 2.54,8.14 U4.3
S_HPD
  Top 0.152: PCIE-SOUTH.B4 18.33,7.66 arc45 18.06,7.55 13.64,3.13 arc-45 13.19,2.95 3.98,2.95 arc-90 3.48,3.46 3.48,12.74 arc-90 3.98,13.25 X3.18
S_ML0_N  (via drill 0.2)
  Top 0.152: X3.3 12,8.85 arc-45 12.14,8.79 12.17,8.76 arc45 12.31,8.7 12.98,8.7 arc-45 13.34,8.55 14.23,7.66 v14.44,7.66
  Bottom 0.152: PCIE-SOUTH.A3 24.98,6.66 arc45 24.72,6.55 24.59,6.42 arc-45 24.32,6.31 15.7,6.31 arc-45 15.49,6.4 14.44,7.45 v14.44,7.66
S_ML0_P  (via drill 0.2)
  Top 0.152: X3.1 12,8.25 arc45 12.14,8.31 12.17,8.34 arc-45 12.31,8.4 12.94,8.4 arc-45 13.15,8.31 14.01,7.45 v14.01,7.23
  Bottom 0.152: PCIE-SOUTH.A2 24.98,5.66 arc-45 24.72,5.77 24.59,5.9 arc45 24.32,6.01 15.66,6.01 arc-45 15.3,6.16 14.23,7.23 v14.01,7.23
S_ML1_N
  Bottom 0.152: PCIE-SOUTH.A6 24.98,9.66 arc45 24.72,9.55 24.59,9.42 arc-45 24.32,9.31 7.36,9.31 arc-45 7,9.46 X3.6
S_ML1_P
  Bottom 0.152: PCIE-SOUTH.A5 24.98,8.66 arc-45 24.72,8.77 24.59,8.9 arc45 24.32,9.01 7.39,9.01 arc45 7.03,8.86 X3.4
S_ML2_N  (via drill 0.2)
  Top 0.152: X3.9 12,10.65 arc-45 12.14,10.59 12.17,10.56 arc45 12.31,10.5 13.94,10.5 arc45 14.15,10.59 14.99,11.42 arc45 15.07,11.64 15.07,13.57 v14.92,13.7
  Bottom 0.152: PCIE-SOUTH.A14 24.98,19.66 arc45 24.72,19.55 24.59,19.42 arc-45 24.32,19.31 17.47,19.31 arc45 17.12,19.17 15.22,17.27 arc45 15.07,16.92 15.07,13.7 v14.92,13.7
S_ML2_P  (via drill 0.2)
  Top 0.152: X3.7 12,10.05 arc45 12.14,10.11 12.17,10.14 arc-45 12.31,10.2 13.98,10.2 arc45 14.34,10.34 15.23,11.24 arc45 15.38,11.59 15.38,13.57 v15.53,13.7
  Bottom 0.152: PCIE-SOUTH.A13 24.98,18.66 arc-45 24.72,18.77 24.59,18.9 arc45 24.32,19.01 17.51,19.01 arc45 17.3,18.92 15.47,17.09 arc45 15.38,16.87 15.38,13.7 v15.53,13.7
S_ML3_N
  Bottom 0.152: PCIE-SOUTH.A9 24.98,12.66 arc45 24.72,12.55 24.59,12.42 arc-45 24.32,12.31 17.58,12.31 arc45 17.23,12.17 16.16,11.1 9.35,11.1 arc-45 9.14,11.19 8.88,11.45 X3.12
S_ML3_P
  Bottom 0.152: PCIE-SOUTH.A8 24.98,11.66 arc-45 24.72,11.77 24.59,11.9 arc45 24.32,12.01 17.62,12.01 arc45 17.41,11.92 16.29,10.8 9.35,10.8 arc45 9.14,10.71 8.88,10.45 X3.10
S_PCIE_V  (via drill 0.2, 0.25)
  Top 0.203: R8.1 v9.48,17.45
  Top 0.406: PCIE-SOUTH.B13 17.01,18.66 v15.48,20.2
  Route2 0.652: v15.48,20.2 13.98,20.2 11.23,17.45 v9.48,17.45
  Bottom 0.406: C6.1 v6.18,5.7 6.18,7 4.42,8.76 U4.1
  pour Route2: 9.73,17.44 arc-90 9.48,17.2 6.23,17.2 arc90 5.98,16.94 5.98,14.3 arc-45 5.9,14.12 5.8,14.02 arc45 5.73,13.84 5.73,8.05 arc45 5.8,7.87 5.9,7.77 arc-45 5.98,7.59 5.98,6.2 arc90 6.23,5.95 arc-90 6.48,5.7 arc-90 6.22,5.45 4.23,5.45 arc-90 3.73,5.96 3.73,17.19 arc-90 4.23,17.7 9.47,17.7 arc-90
S_PWR
  Bottom 0.406: X3.20 7.53,13.65 7.23,13.95 6.18,13.95 | U4.5 4.42,13.14 4.73,13.45 5.68,13.45 6.18,13.95 | C7.1 6.18,13.95
SCL
  Top 0.152: U1.6 20.57,33.73 arc-90 21.08,34.23 PCIE-NORTH.B2
SDA
  Top 0.152: U1.5 21.08,33.55 arc-90 21.34,33.8 23.75,33.8 arc-45 24.02,33.69 24.37,33.35 arc45 24.64,33.23 PCIE-NORTH.B1

### Text on the board
tDocu: HIGH SPEED IO
_bSilk: V1.1 / R1.0 | Triple mini DP / Dual Plugin Module | Copyright (C) 2016 Herbert Pötzl / Licensed under CERN OHL v.1.2
tEngrave: AXIOM BETA DPM 3xDP / TOP SIDE V1.1 R1.0
bEngrave: AXIOM BETA DPM 3xDP / BOTTOM SIDE V1.1 R1.0